# EAGLE design SensorModule (EAGLE 7.5.0)
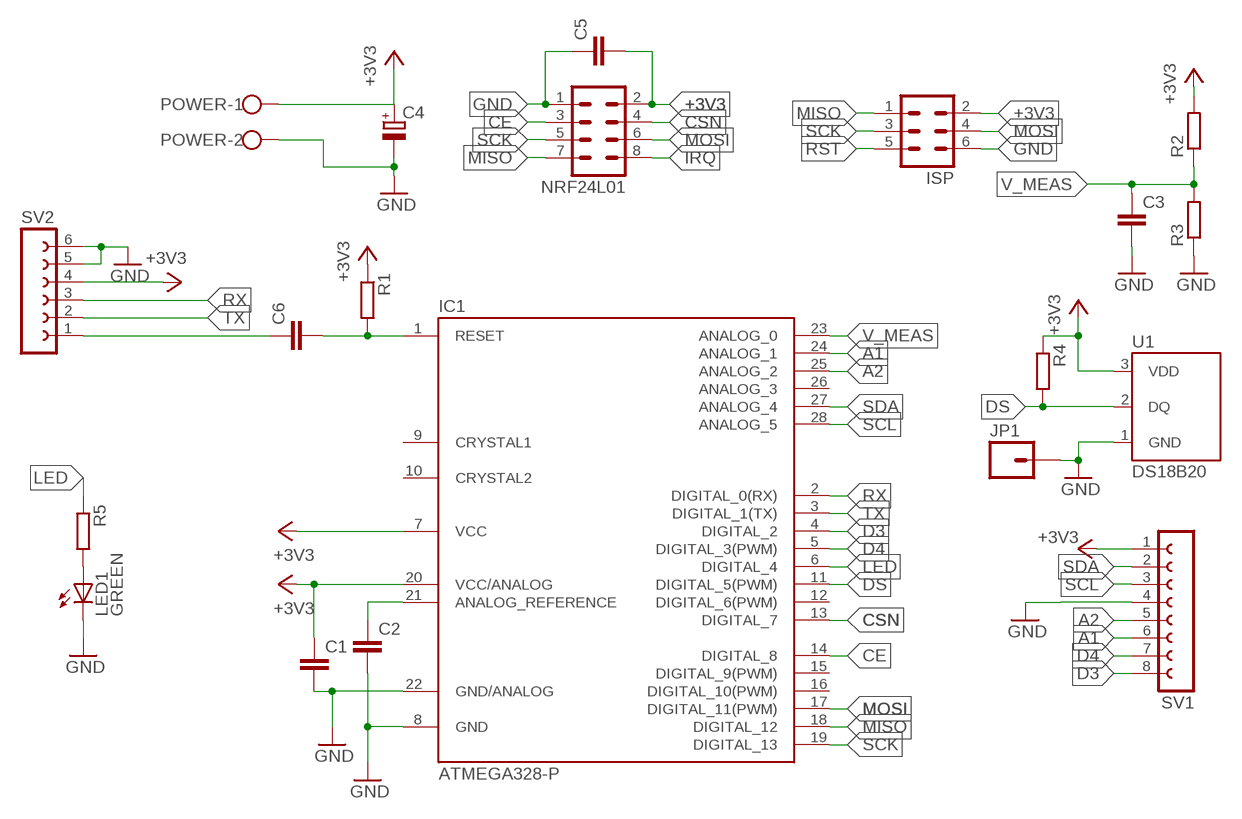
[diagram p0: schematic, sheet 1]

## Parts
C1  C-EU025-025X050  [C025-025X050]
C2  C-EU025-025X050  [C025-025X050]
C3  C-EU025-025X050  [C025-025X050]
C4  CPOL-EUE2.5-5  [E2,5-5]
C5  C-EU025-025X050  [C025-025X050]
C6  C-EU025-025X050  [C025-025X050]
IC1  ATMEGA328-P  ATMEGA168-PU  [DIL28-3]
ISP  MA03-2  [MA03-2]
JP1  M01PTH_LONGPAD  [1X01_LONGPAD]
LED1  GREEN  LED5MM  [LED5MM]
NRF24L01  MA04-2  [MA04-2]
POWER  W237-102  [W237-102]
R1  R-EU_0204/2V  [0204V]
R2  R-EU_0204/2V  [0204V]
R3  R-EU_0204/2V  [0204V]
R4  R-EU_0204/2V  [0204V]
R5  R-EU_0204/2V  [0204V]
SV1  FE08-1  [FE08]
SV2  FE06-1  [FE06]
U1  DS18B20  [TO-92-AMMO]

## Nets
+3V3: C1.1 C4.+ C5.2 IC1.7(VCC) IC1.20(VCC/ANALOG) ISP.2 NRF24L01.2 POWER.1 R1.1 R2.2 R4.1 SV1.1 SV2.4 U1.3(VDD)
A1: IC1.24(ANALOG_1) SV1.6
A2: IC1.25(ANALOG_2) SV1.5
CE: IC1.14(DIGITAL_8) NRF24L01.3
CSN: IC1.13(DIGITAL_7) NRF24L01.4
D3: IC1.4(DIGITAL_2) SV1.8
D4: IC1.5(DIGITAL_3(PWM)) SV1.7
DS: IC1.11(DIGITAL_5(PWM)) R4.2 U1.2(DQ)
GND: C1.2 C2.2 C3.2 C4.- C5.1 IC1.8(GND) IC1.22(GND/ANALOG) ISP.6 JP1.1 LED1.K(C) NRF24L01.1 POWER.2 R3.1 SV1.4 SV2.5 SV2.6 U1.1(GND)
IRQ: NRF24L01.8
LED: IC1.6(DIGITAL_4) R5.1
MISO: IC1.18(DIGITAL_12) ISP.1 NRF24L01.7
MOSI: IC1.17(DIGITAL_11(PWM)) ISP.4 NRF24L01.6
N$2: C6.2 IC1.1(RESET) R1.2
N$3: C2.1 IC1.21(ANALOG_REFERENCE)
N$5: C6.1 SV2.1
N$12: LED1.A R5.2
RST: ISP.5
RX: IC1.2(DIGITAL_0(RX)) SV2.3
SCK: IC1.19(DIGITAL_13) ISP.3 NRF24L01.5
SCL: IC1.28(ANALOG_5) SV1.3
SDA: IC1.27(ANALOG_4) SV1.2
TX: IC1.3(DIGITAL_1(TX)) SV2.2
V_MEAS: C3.1 IC1.23(ANALOG_0) R2.1 R3.2
Unconnected: IC1.9(CRYSTAL1) IC1.10(CRYSTAL2) IC1.12(DIGITAL_6(PWM)) IC1.15(DIGITAL_9(PWM)) IC1.16(DIGITAL_10(PWM)) IC1.26(ANALOG_3)

## Library data of the parts
C1-C3 C5 C6 = resistor:C-EU: CAPACITOR, European symbol
C4 = resistor:CPOL-EU: POLARIZED CAPACITOR, European symbol
IC1 = Arduino-AVR:ATMEGA168-PU
ISP = con-lstb:MA03-2: PIN HEADER; OC_FARNELL: unknown; OC_NEWARK: unknown
JP1 = SparkFun-Connectors:M01: Header 1 Standard 1-pin 0.1" header. Use with straight break away headers (SKU : PRT-00116), right angle break away headers (PRT-00553), swiss pins (PRT-00743), machine pins (PRT-00117), and female headers (PRT-00115). SMTSO-256-ET is a "flush mount" nut for a 4-40 screw. The older package used to be too tight, and did not allow it to sit properly thru the drill hit. The latest (0.165DIA) fits nice and snug.
LED1 = led:LED: LED OSRAM: - CHIPLED LG R971, LG N971, LY N971, LG Q971, LY Q971, LO R971, LY R971 LH N974, LH R974 LS Q976, LO Q976, LY Q976 LO Q996 - Hyper CHIPLED LW Q18S LB Q993, LB Q99A, LB R99A - SideLED LS A670, LO A670, LY A670, LG A670, LP A670 LB A673, LV A673, LT A673, LW A673 LH A674 LY A675 LS A676, LA A676, LO A676, LY A676, LW A676 LS A679, LY A679, LG A679 - Hyper Micro SIDELED® LS Y876, LA Y876, LO Y876, LY Y876 LT Y87S - SmartLED LW L88C, LW L88S LB L89C, LB L89S, LG L890 LS L89K, LO L89K, LY L89K LS L896, LA L896, LO L896, LY L896 - TOPLED LS T670, LO T670, LY T670, LG T670, LP T670 LSG T670, LSP T670, LSY T670, LOP T670, LYG T670 LG T671, LOG T671, LSG T671 LB T673, LV T673, LT T673, LW T673 LH T674 LS T676, LA T676, LO T676, LY T676, LB T676, LH T676, LSB T676, LW T676 LB T67C, LV T67C, LT T67C, LS T67K, LO T67K, LY T67K, LW E67C LS E67B, LA E67B, LO E67B, LY E67B, LB E67C, LV E67C, LT E67C LW T67C LS T679, LY T679, LG T679 LS T770, LO T770, LY T770, LG T770, LP T770 LB T773, LV T773, LT T773, LW T773 LH T774 LS E675, LA E675, LY E675, LS T675 LS T776, LA T776, LO T776, LY T776, LB T776 LHGB T686 LT T68C, LB T68C - Hyper Mini TOPLED® LB M676 - Mini TOPLED Santana® LG M470 LS M47K, LO M47K, LY M47K Source: http://www.osram.convergy.de LUXEON: - LUMILED® LXK2-PW12-R00, LXK2-PW12-S00, LXK2-PW14-U00, LXK2-PW14-V00 LXK2-PM12-R00, LXK2-PM12-S00, LXK2-PM14-U00 LXK2-PE12-Q00, LXK2-PE12-R00, LXK2-PE12-S00, LXK2-PE14-T00, LXK2-PE14-U00 LXK2-PB12-K00, LXK2-PB12-L00, LXK2-PB12-M00, LXK2-PB14-N00, LXK2-PB14-P00, LXK2-PB14-Q00 LXK2-PR12-L00, LXK2-PR12-M00, LXK2-PR14-Q00, LXK2-PR14-R00 LXK2-PD12-Q00, LXK2-PD12-R00, LXK2-PD12-S00 LXK2-PH12-R00, LXK2-PH12-S00 LXK2-PL12-P00, LXK2-PL12-Q00, LXK2-PL12-R00 Source: www.luxeon.com KINGBRIGHT: KA-3528ASYC Source: www.kingbright.com
NRF24L01 = con-lstb:MA04-2: PIN HEADER; OC_FARNELL: unknown; OC_NEWARK: unknown
POWER = con-wago-500:W237-102: WAGO SCREW CLAMP; MPN: 237-102; OC_FARNELL: unknown; OC_NEWARK: 70K9898
R1-R5 = resistor:R-EU_: RESISTOR, European symbol
SV1 = con-lsta:FE08-1: FEMALE HEADER; OC_FARNELL: unknown; OC_NEWARK: unknown
SV2 = con-lsta:FE06-1: FEMALE HEADER; OC_FARNELL: unknown; OC_NEWARK: unknown
U1 = SparkFun-Sensors:DS18B20: Dallas/Maxim DS18B20 1-wire temperature sensor Datasheet: http://datasheets.maximintegrated.com/en/ds/DS18B20.pdf temp thermometer 1-wire one-wire one wire; STORE_ID: SEN-00245

## Board
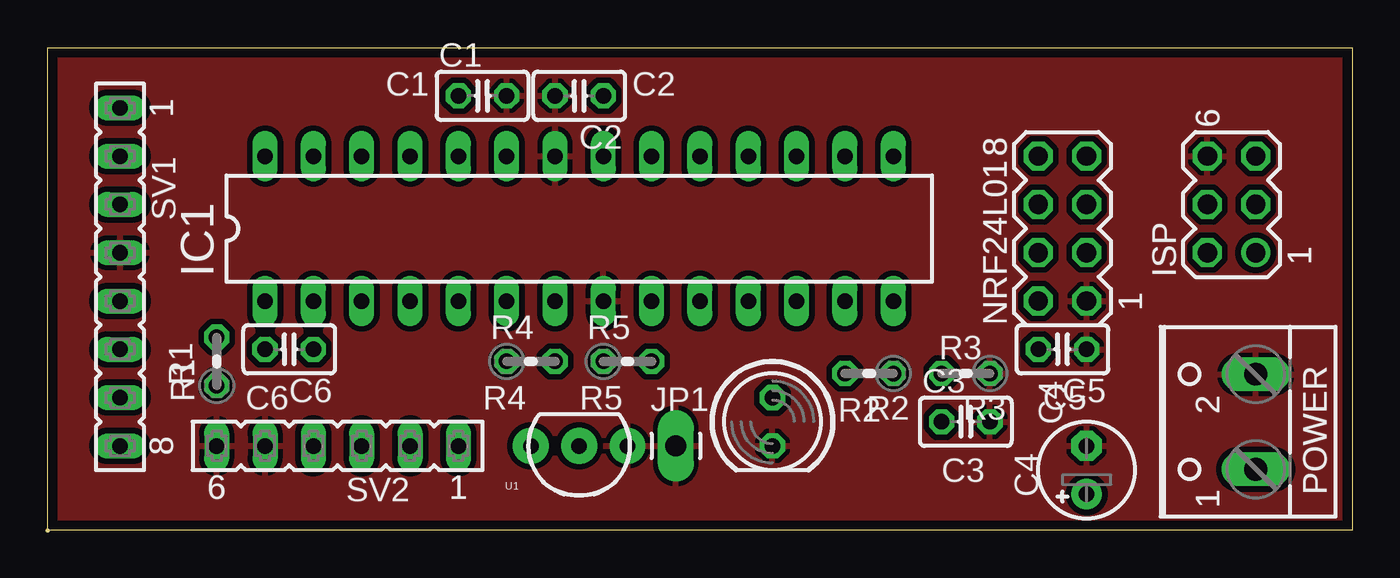
[diagram p1: board, top side]
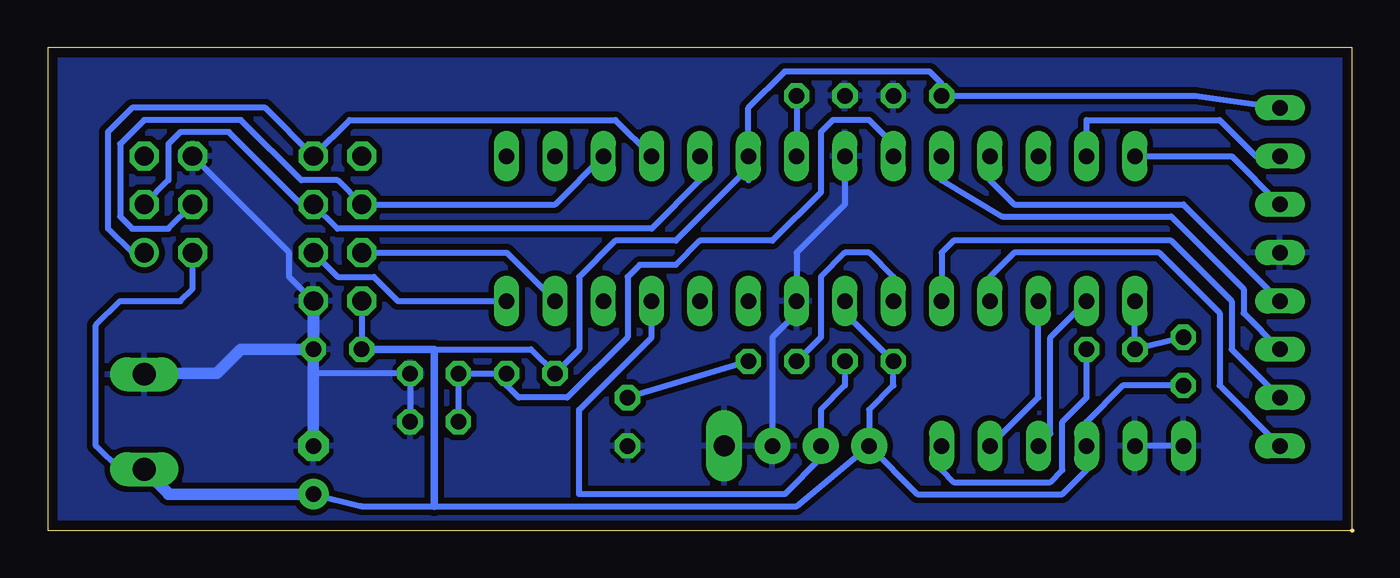
[diagram p2: board, bottom side, seen from below]

Size 68.58 x 25.4 mm. Coordinates in mm from the lower left corner, seen from the top.
Outline: 0.01,0 0,0
Outline: 0,0 0,25.4 68.58,25.4 68.58,0 0,0
Copper layers (1*16): Top 0.035mm / dielectric 1.5mm / Bottom 0.035mm
Design rules "ShenZhen2U EagleRules": minimum track width 7mil, minimum drill 12mil, track to track 7mil, track to pad 7mil, pad to pad 7mil, via to via 7mil, smd to smd 0mil, copper to edge 20mil, drill to drill 10mil, minimum pad ring 10mil, minimum via ring 6mil, stop-mask expansion 2mil, vias tented up to drill 25mil, thermal gap 10mil

### Footprints (pad centres in the part's own frame; a part is rotated, then mirrored left to right if it is on the bottom)
C025-025X050 = drill 0.813 octagon: 1 -1.27,0; 2 1.27,0
E2,5-5 = drill 0.813 pad 1.6: + -1.27,0 | drill 0.813 pad 1.6 octagon: - 1.27,0
DIL28-3 = drill 0.813 long: 1 -16.51,-3.81; 2 -13.97,-3.81; 3 -11.43,-3.81; 4 -8.89,-3.81; 5 -6.35,-3.81; 6 -3.81,-3.81; 7 -1.27,-3.81; 8 1.27,-3.81; 9 3.81,-3.81; 10 6.35,-3.81; 11 8.89,-3.81; 12 11.43,-3.81; 13 13.97,-3.81; 14 16.51,-3.81; 15 16.51,3.81; 16 13.97,3.81; 17 11.43,3.81; 18 8.89,3.81; 19 6.35,3.81; 20 3.81,3.81; 21 1.27,3.81; 22 -1.27,3.81; 23 -3.81,3.81; 24 -6.35,3.81; 25 -8.89,3.81; 26 -11.43,3.81; 27 -13.97,3.81; 28 -16.51,3.81
MA03-2 = drill 1.016: 1 -2.54,-1.27 | drill 1.016 octagon: 2 -2.54,1.27; 3 0,-1.27; 4 0,1.27; 5 2.54,-1.27; 6 2.54,1.27
1X01_LONGPAD = drill 1.118 pad 1.88 long: 1 0,0
LED5MM = drill 0.813 octagon: A -1.27,0; K 1.27,0
MA04-2 = drill 1.016 octagon: 1 -3.81,-1.27; 2 -3.81,1.27; 3 -1.27,-1.27; 4 -1.27,1.27; 5 1.27,-1.27; 6 1.27,1.27; 7 3.81,-1.27; 8 3.81,1.27
W237-102 = drill 1.194 long: 1 -2.5,-1.27; 2 2.5,-1.27
0204V = drill 0.813 octagon: 1 -1.27,0; 2 1.27,0
FE08 = drill 0.813 long: 1 -8.89,0; 2 -6.35,0; 3 -3.81,0; 4 -1.27,0; 5 1.27,0; 6 3.81,0; 7 6.35,0; 8 8.89,0
FE06 = drill 0.813 long: 1 -6.35,0; 2 -3.81,0; 3 -1.27,0; 4 1.27,0; 5 3.81,0; 6 6.35,0
TO-92-AMMO = drill 0.813 pad 1.88: 1 -2.54,0; 2 0,0; 3 2.54,0

### Placement (x,y rotation side)
C1  22.86,22.86 0 top
C2  27.94,22.86 180 top
C3  48.26,5.71 0 top
C4  54.61,3.17 90 top
C5  53.34,9.53 180 top
C6  12.7,9.53 180 top
IC1  27.94,15.88 0 top
ISP  62.23,17.14 90 top
JP1  33.02,4.45 0 top
LED1  38.1,5.71 270 top
NRF24L01  53.34,15.88 90 top
POWER  62.23,5.71 90 top
R1  8.89,8.89 90 top
R2  43.18,8.26 180 top
R3  48.26,8.26 180 top
R4  25.4,8.89 0 top
R5  30.48,8.89 0 top
SV1  3.81,13.34 270 top
SV2  15.24,4.45 180 top
U1  27.94,4.45 180 top

### Tracks (layer width: path | path; a pad name or v marks a point on that pad's centre or on a via)
+3V3
  Bottom 0.305: NRF24L01.2 C5.2 43.18,9.53 R2.2 40.64,9.53 40.64,13.34 38.73,15.24 35.56,15.24 31.75,19.05 | ISP.2 60.96,12.7 61.59,12.06 64.77,12.06 66.04,10.79 66.04,4.45 64.77,3.17 63.54,3.17 POWER.1 | U1.3 29.21,1.27 48.26,1.27 52.07,1.27 C4.+ | 31.75,19.05 IC1.20 31.75,22.23 29.84,24.13 22.23,24.13 21.59,23.5 C1.1 8.26,22.86 SV1.1 | U1.3 22.86,1.91 15.24,1.91 13.97,3.17 SV2.4 13.97,5.71 12.06,7.62 R1.1 | U1.3 25.4,6.35 24.13,7.62 R4.1 26.67,11.43 IC1.7 | 31.75,18.41 31.75,19.05
  Bottom 0.406: C5.2 48.26,9.53 48.26,1.27
  Bottom 0.61: C4.+ 62.23,1.91 62.23,1.95 POWER.1
A1
  Bottom 0.305: IC1.24 21.59,18.41 18.41,16.51 9.53,16.51 5.71,12.7 5.71,11.43 SV1.6
A2
  Bottom 0.305: IC1.25 19.05,18.41 17.78,17.14 8.89,17.14 SV1.5
CE
  Bottom 0.305: IC1.14 50.16,12.06 51.44,13.34 53.34,13.34 NRF24L01.3
CSN
  Bottom 0.305: IC1.13 44.45,14.61 NRF24L01.4
D3
  Bottom 0.305: SV1.8 6.99,7.62 6.99,11.43 10.16,14.61 17.78,14.61 19.05,13.34 IC1.4
D4
  Bottom 0.305: SV1.7 6.35,9.53 6.35,12.06 9.53,15.24 20.95,15.24 21.59,14.61 IC1.5
DS
  Bottom 0.305: R4.2 26.67,7.62 27.94,6.35 U1.2 27.94,3.81 29.84,1.91 40.64,1.91 40.64,6.35 36.83,10.16 IC1.11
GND
  Bottom 0.305: SV2.6 SV2.5 | C3.2 R3.1 54.61,8.26 | ISP.6 55.88,14.61 55.88,13.34 NRF24L01.1 | IC1.22 26.67,17.14 29.21,14.61 IC1.8 29.21,11.43 30.48,10.16 U1.1 | 63.5,8.26 POWER.2
  Bottom 0.61: C4.- 54.61,8.26 C5.1 58.42,9.53 59.69,8.26 63.5,8.26
  Bottom 0.635: NRF24L01.1 C5.1
  pour Bottom (isolate 0.305): 0,25.4 0,0 68.58,0 68.58,25.4
  pour Top (isolate 0.305): 0,25.4 0,0 68.58,0 68.58,25.4
LED
  Bottom 0.305: IC1.6 24.13,13.34 25.4,14.61 26.67,14.61 27.94,13.34 27.94,10.16 R5.1
MISO
  Bottom 0.305: IC1.18 38.73,21.59 52.7,21.59 NRF24L01.7 57.15,22.23 64.14,22.23 65.41,20.95 65.41,15.88 64.14,14.61 ISP.1
MOSI
  Bottom 0.305: IC1.17 41.91,17.14 NRF24L01.6 53.34,18.41 55.24,18.41 58.42,21.59 63.5,21.59 64.77,20.32 64.77,16.51 64.14,15.88 62.23,15.88 ISP.4
N$2
  Bottom 0.305: R1.2 C6.2 IC1.1
N$3
  Bottom 0.305: C2.1 IC1.21
N$5
  Bottom 0.305: SV2.1 21.59,3.17 20.95,2.54 15.88,2.54 15.24,3.17 15.24,5.71 13.97,6.99 C6.1
N$12
  Bottom 0.305: R5.2 LED1.A
RX
  Bottom 0.305: IC1.2 15.88,10.16 15.88,5.08 SV2.3
SCK
  Bottom 0.305: ISP.3 62.23,18.41 62.23,20.32 61.59,20.95 59.05,20.95 55.24,17.14 NRF24L01.5 53.34,15.88 36.83,15.88 34.29,18.41 IC1.19
SCL
  Bottom 0.305: IC1.28 6.35,19.68 SV1.3
SDA
  Bottom 0.305: SV1.2 5.08,19.68 6.99,21.59 13.97,21.59 IC1.27
TX
  Bottom 0.305: IC1.3 16.51,6.99 SV2.2
V_MEAS
  Bottom 0.305: C3.1 R3.2 R2.1 44.45,7.62 43.81,6.99 41.27,6.99 38.1,10.16 38.1,13.34 37.47,13.97 35.56,13.97 34.29,15.24 30.48,15.24 27.94,17.78 27.94,20.95 27.3,21.59 25.4,21.59 24.13,20.32 IC1.23

### Text on the board
_tsilk: C2 | 1 | C1 | 6 | 8 | 1 | ISP | 1 | NRF24L01 | R3 | R1 | C6 | C5 | R2 | R4 | R5 | 2 | 8 | 6 | 1 | C3 | C4 | POWER | 1